# Altium schematic sheet isolation.SCHDOC
size B
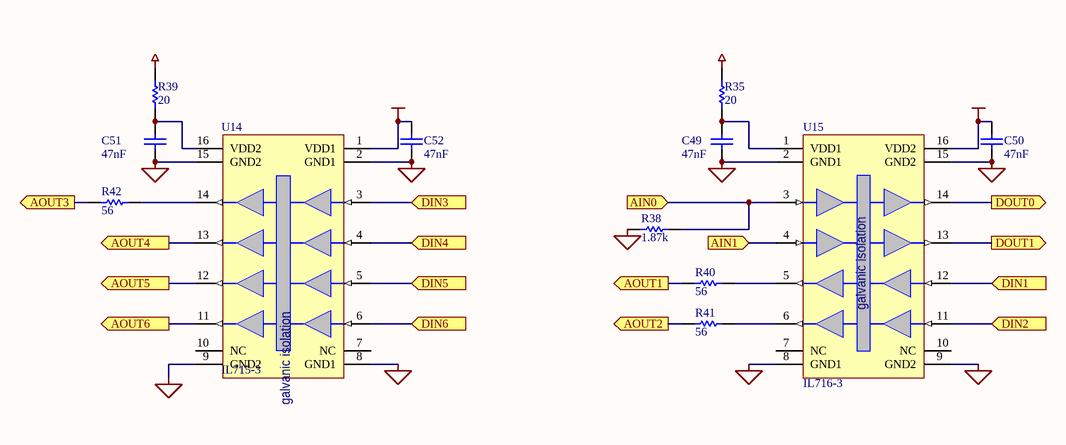
[diagram p0: isolation.SCHDOC]

## Parts
C49  value 47nF  [CC1608-0603]  (hidden comment: Cap)
C50  value 47nF  [CC1608-0603]  (hidden comment: Cap)
C51  value 47nF  [CC1608-0603]  (hidden comment: Cap)
C52  value 47nF  [CC1608-0603]  (hidden comment: Cap)
R35  value 20  [CC1608-0603]  (hidden comment: Res1)
R38  value 1.87k  [CC1608-0603]  (hidden comment: Res1)
R39  value 20  [CC1608-0603]  (hidden comment: Res1)
R40  value 56  [CC1608-0603]  (hidden comment: Res1)
R41  value 56  [CC1608-0603]  (hidden comment: Res1)
R42  value 56  [CC1608-0603]  (hidden comment: Res1)
U14  IL715-3  [SO-G16/D10]
U15  IL716-3  [SO-G16/D10]

## Ports
AIN0 (in), AIN1 (in), AOUT1 (out), AOUT2 (out), AOUT3 (out), AOUT4 (out), AOUT5 (out), AOUT6 (out), DIN1 (in), DIN2 (in), DIN3 (in), DIN4 (in), DIN5 (in), DIN6 (in), DOUT0 (out), DOUT1 (out)

## Nets
AGND: C49.1 C51.1 R38.1 U14.9(GND2) U14.15(GND2) U15.2(GND1) U15.8(GND1)
AVDD: R35.2 R39.2
GND: C50.1 C52.1 U14.2(GND1) U14.8(GND1) U15.9(GND2) U15.15(GND2)
VCC: C50.2 C52.2 U14.1(VDD1) U15.16(VDD2)
AIN0: R38.2 U15.3(IN1) ; port AIN0
AIN1: U15.4(IN2) ; port AIN1
AOUT1: R40.1 ; port AOUT1
AOUT2: R41.1 ; port AOUT2
AOUT3: R42.1 ; port AOUT3
AOUT4: U14.13(OUT2) ; port AOUT4
AOUT5: U14.12(OUT3) ; port AOUT5
AOUT6: U14.11(OUT4) ; port AOUT6
DIN1: U15.12(IN3) ; port DIN1
DIN2: U15.11(IN4) ; port DIN2
DIN3: U14.3(IN1) ; port DIN3
DIN4: U14.4(IN2) ; port DIN4
DIN5: U14.5(IN3) ; port DIN5
DIN6: U14.6(IN4) ; port DIN6
DOUT0: U15.14(OUT1) ; port DOUT0
DOUT1: U15.13(OUT2) ; port DOUT1
NetC49_2: C49.2 R35.1 U15.1(VDD1)
NetC51_2: C51.2 R39.1 U14.16(VDD2)
NetR40_2: R40.2 U15.5(OUT3)
NetR41_2: R41.2 U15.6(OUT4)
NetR42_2: R42.2 U14.14(OUT1)

Not connected (* = marked no-connect by the designer): U14 7(NC) 10(NC); U15 7(NC) 10(NC)

## Notes on the sheet
- (in symbol IL715-3) galvanic isolation
- (in symbol IL716-3) galvanic isolation

## Library data of the parts
C49-C52 = Cap: Capacitor; Manufacturer: Generic Components; Class I: Passive; Published: 8-Jun-2000; Revision: July-2002: Re-released for DXP Platform.; Publisher: Altium Limited; Class II: Capacitor
R35 R38-R42 = Res1: Resistor; Manufacturer: Generic Components; Class I: Passive; Published: 8-Jun-2000; Revision: July-2002: Re-released for DXP Platform.; Publisher: Altium Limited; Class II: Resistor
U14 = IL715-3: High speed digital coupler; Vendor: NVE Corp/Isolation Products
U15 = IL716-3: High speed digital coupler; Vendor: NVE Corp/Isolation Products